# Altium schematic sheet 5_shkb_power_supply.SchDoc: =ProjectTitle
size A4; Address1: github.com/4pplet/SHKB; Address2: Licence: CERN-OHL-S; SheetNumber: 6; SheetTotal: 7
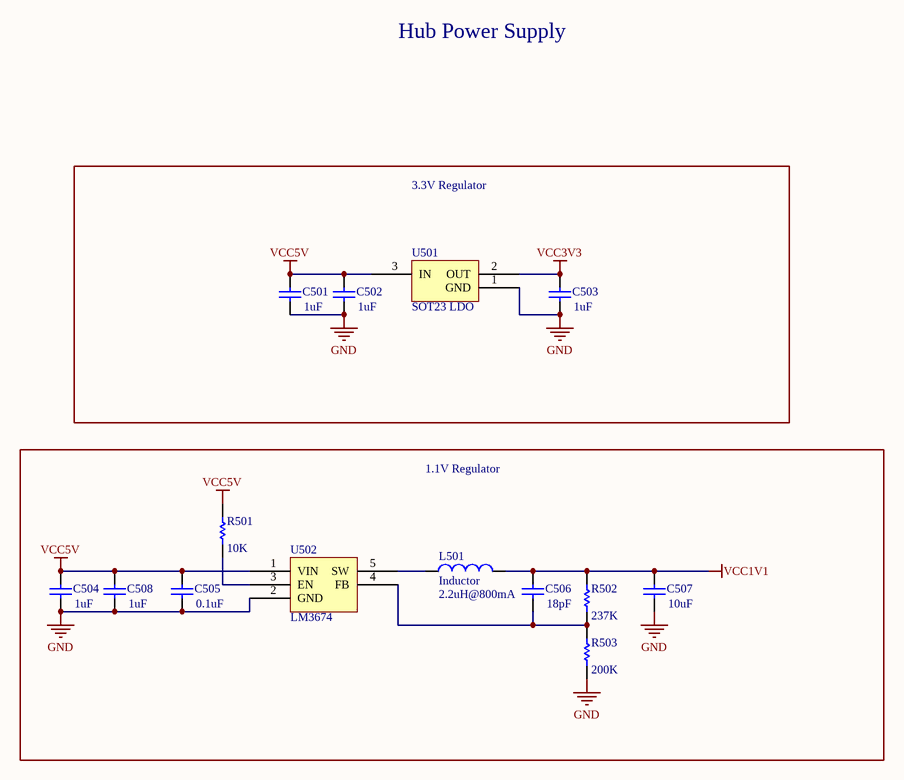
[diagram p0: 5_shkb_power_supply.SchDoc]

## Parts
C501  value 1uF  [C0603[1608]]
C502  value 1uF  [C0603[1608]]
C503  value 1uF  [C0603[1608]]
C504  value 1uF  [C0603[1608]]
C505  value 0.1uF  [C0603[1608]]
C506  value 18pF  [C0603[1608]]
C507  value 10uF  [C1206[3216]]
C508  value 1uF  [C0603[1608]]
L501  Inductor  value 2.2uH@800mA  [C0805]
R501  value 10K  [R0603[1608]]
R502  value 237K  [R0603[1608]]
R503  value 200K  [R0603[1608]]
U501  SOT23 LDO  [SOT-23-3]
U502  LM3674  [SOT-23-5]

## Blocks framed on the sheet
3.3V Regulator: C501-C503 U501
1.1V Regulator: C504-C508 L501 R501-R503 U502

## Nets
GND: C501.1 C502.1 C503.1 C504.1 C505.1 C507.1 C508.1 R503.2 U501.1(GND) U502.2(GND)
VCC1V1: C506.2 C507.2 L501.2 R502.1
VCC3V3: C503.2 U501.2(OUT)
VCC5V: C501.2 C502.2 C504.2 C505.2 C508.2 R501.1 U501.3(IN) U502.1(VIN)
NetC506_1: C506.1 R502.2 R503.1 U502.4(FB)
NetL501_1: L501.1 U502.5(SW)
NetR501_2: R501.2 U502.3(EN)

## Notes on the sheet
- Hub Power Supply
- Title
- Size:
- Date:
- A4
- Number:
- Time:
- Revision:
- Sheet
- of
- File:

## Library data of the parts
C501-C503 = Cap: Capacitor; MRF.Part: CL10A105KB8NNNC; MFG: KEMET; MFGPN: C0603C104M5RACTU; LCSC MFG: Samsung Electro-Mechanics; Version: 0603 imperial; LCSC Part #: C15849
C504 C508 = Cap: Capacitor; MRF.Part: CL10A105KB8NNNC; MFG: KEMET; MFGPN: C0603C105K4RACTU; LCSC MFG: Samsung Electro-Mechanics; Version: 0603 imperial; JLC: BASIC; LCSC Part #: C15849
C505 = Cap: Capacitor; MRF.Part: CC0603KRX7R9BB104; MFG: KEMET; MFGPN: C0603C104M5RACTU; LCSC MFG: YAGEO; Version: 0603 imperial; JLC: BASIC; LCSC Part #: C14663
C506 = Cap: Capacitor; MRF.Part: CL10C180JB8NNNC; MFG: KEMET; MFGPN: C0603C180J5GACAUTO; LCSC MFG: Samsung Electro-Mechanics; Version: 0603 imperial; JLC: BASIC; LCSC Part #: C1647
C507 = Cap: Capacitor; MRF.Part: CL31A106KBHNNNE; MFG: KEMET; MFGPN: C1206C106K4PACTU; LCSC MFG: Samsung Electro-Mechanics; Version: 1206 imperial; JLC: BASIC; LCSC Part #: C13585
L501 = Inductor: MFGPN: MLP2012S2R2MT0S1; MFG: TDK; JLC: Yes; LCSC MFG: TDK; LCSC Part #: C107322; MRF.Part: MLP2012S2R2MT0S1
R501 = Res1: Resistor; MRF.Part: 0603WAF1002T5E; MFG: Vishay Dale; MFGPN: RCA060310K0FKEA; LCSC MFG: Uniroyal Elec; Version: 0603 imperial; JLC: BASIC; LCSC Part #: C25804
R502 = Res1: Resistor; MRF.Part: 0603WAF2373T5E; MFG: Vishay Dale; MFGPN: CRCW0603237KFKEA; LCSC MFG: Uniroyal Elec; Version: 0603 imperial; JLC: EXTENDED; LCSC Part #: C22914
R503 = Res1: Resistor; MRF.Part: 0603WAF2003T5E; MFG: Vishay Dale; MFGPN: CRCW0603200KFKEB; LCSC MFG: Uniroyal Elec; Version: 0603 imperial; JLC: BASIC; LCSC Part #: C25811
U501 = SOT23 LDO: MRF.Part: XC6206P332MR; LCSC MFG: Torex Semicon; MFG: Texas Instruments; MFGPN: TPS7A0533PDBZ; LCSC Part #: C5446
U502 = LM3674: MFGPN: LM3674MF-ADJ/NOPB; MFG: Texas Instruments; JLC: NONE; LCSC MFG: Texas Instruments; LCSC Part #: C52027; MRF.Part: LM3674MF-ADJ/NOPB